# EAGLE design SP (EAGLE 9.4.2)
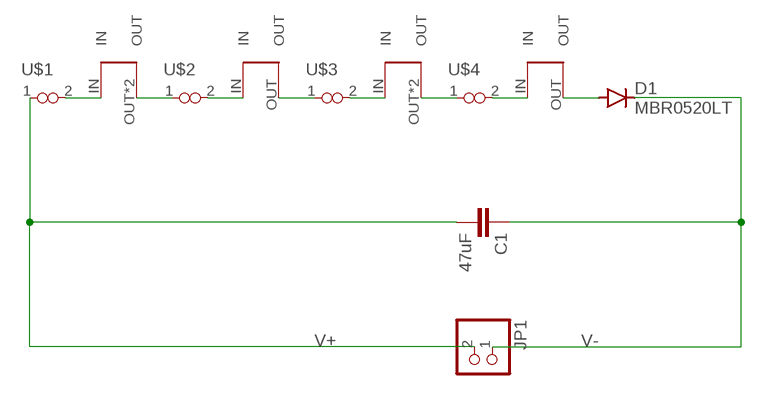
[diagram p0: schematic, sheet 1]

## Parts
C1  47uF  C-EUC1210  [C1210]
D1  MBR0520LT  [SOD123]
JP1  PINHD-1X2  [1X02]
U$1  VIAS-CONNECT  [VIAS-CONNECT]
U$2  VIAS-CONNECT  [VIAS-CONNECT]
U$3  VIAS-CONNECT  [VIAS-CONNECT]
U$4  VIAS-CONNECT  [VIAS-CONNECT]
U$5  SOLAR_1  [SOLAR_1]
U$6  SOLAR_0  [SOLAR_0]
U$7  SOLAR_0  [SOLAR_0]
U$8  SOLAR_1  [SOLAR_1]

## Nets
N$1: U$1.2 U$7.IN
N$2: U$2.1 U$7.OUT U$7.OUT-21(OUT)
N$3: U$2.2 U$5.IN
N$4: D1.A U$8.OUT
N$5: U$3.1 U$5.OUT
N$6: U$3.2 U$6.IN
N$7: U$4.1 U$6.OUT U$6.OUT-21(OUT)
N$8: U$4.2 U$8.IN
V+: C1.2 JP1.2 U$1.1
V-: C1.1 D1.C JP1.1

## Library data of the parts
C1 = rcl:C-EU: CAPACITOR, European symbol; SPICEPREFIX: C
D1 = diode:MBR0520LT: SCHOTTKY BARRIER RECTIFIER Source: http://onsemi.com .. MBR0520LT1-D.pdf
JP1 = pinhead:PINHD-1X2: PIN HEADER
U$1-U$4 = SBV:VIAS-CONNECT
U$5-U$8 = SBV:SOLAR

## Board
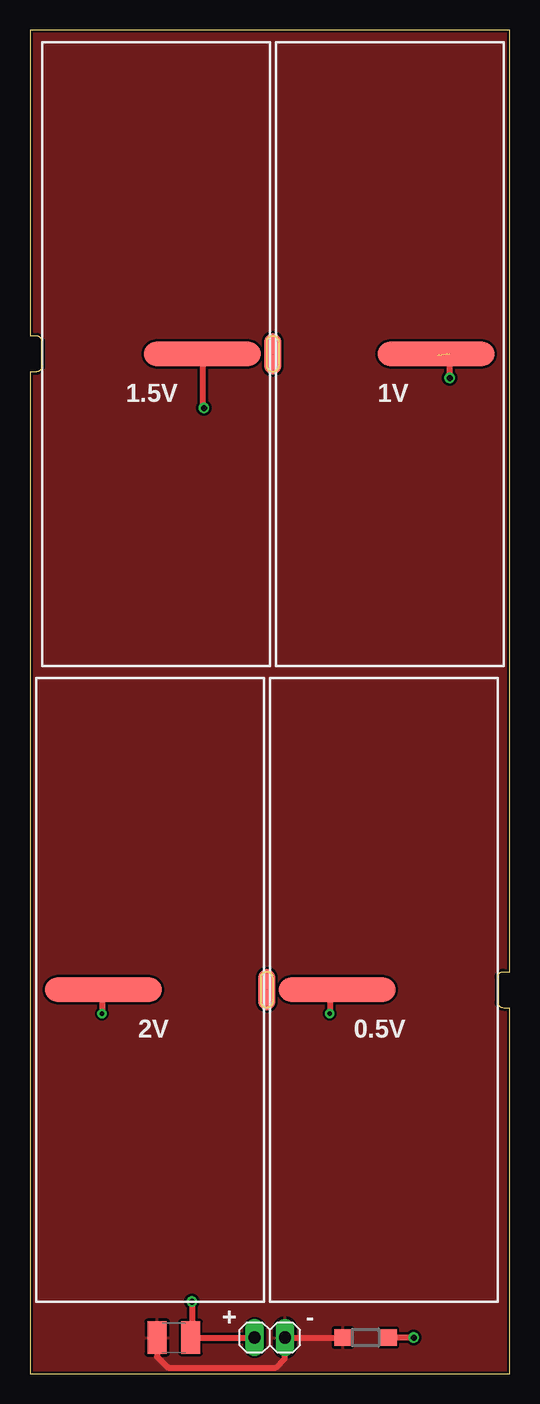
[diagram p1: board, top side]
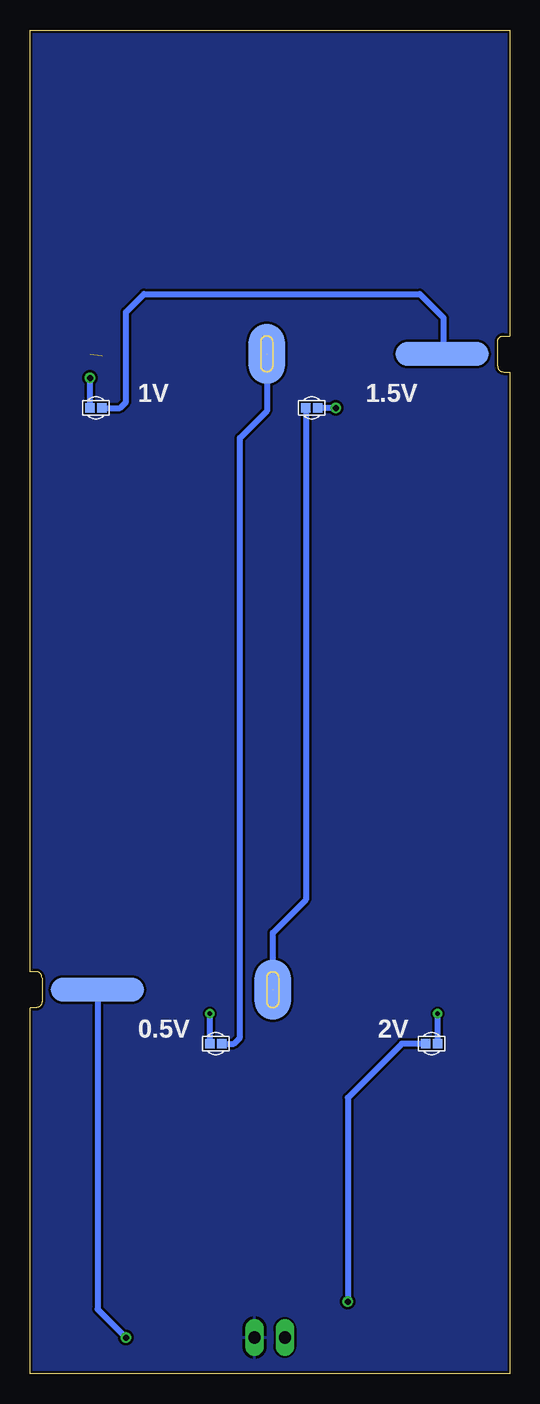
[diagram p2: board, bottom side, seen from below]

Size 40 x 112 mm. Coordinates in mm from the lower left corner, seen from the top.
Outline: 0,0 40,0 40,30.5 39.5,30.5 arc-90 39,31 39,33 arc-90 39.5,33.5 40,33.5 40,112 0,112 0,86.5 0.5,86.5 arc-90 1,86 1,84 arc-90 0.5,83.5 0,83.5 0,0
Copper layers (1*16): Top 0.035mm / dielectric 1.5mm / Bottom 0.035mm
Design rules "default *": minimum track width 0.2mm, minimum drill 0.35mm, track to track 0.2mm, track to pad 0.2mm, pad to pad 0.2mm, via to via 0.2mm, smd to smd 0.2mm, copper to edge 0.2mm, drill to drill 0.2mm, minimum pad ring 10mil, minimum via ring 8mil, stop-mask expansion 4mil, vias tented up to drill 0mil, thermal gap 10mil

### Footprints (pad centres in the part's own frame; a part is rotated, then mirrored left to right if it is on the bottom)
C1210 = smd 1.6 x 2.7: 1 -1.4,0; 2 1.4,0
SOD123 = smd 1.4 x 1.4: A 1.9,0; C -1.9,0
1X02 = drill 1.016 long: 1 -1.27,0; 2 1.27,0
VIAS-CONNECT = smd 0.8 x 0.8: 1 -0.5,0; 2 0.5,0
SOLAR_1 = smd 2 x 9.75: IN 0,-3.875 | smd 2 x 7.75 bottom: OUT 0,4.875
SOLAR_0 = smd 2 x 9.75: IN 0,-3.875 | smd 5 x 3 bottom: OUT 0,9.75 | smd 3.4 x 1.4: OUT-21 0,9.75

### Placement (x,y rotation side)
C1  12,3 0 top
D1  28,3 0 top
JP1  20,3 180 top
U$1  6.5,27.5 0 bottom
U$2  16.5,80.5 0 bottom
U$3  34.5,80.5 180 bottom
U$4  24.5,27.5 180 bottom
U$5  10.5,85 90 top
U$6  30,85 90 top
U$7  10,32 270 top
U$8  29.5,32 270 top

### Tracks (layer width: path | path; a pad name or v marks a point on that pad's centre or on a via)
N$1  (via drill 0.35)
  Top 0.5: U$7.IN 6,31.88 v6,30
  Bottom 0.5: U$1.2 v6,30
N$2  (1 unrouted)
  Bottom 0.5: U$2.1 17,39.5 19.75,36.75 U$7.OUT-21
N$3  (via drill 0.5)
  Top 0.5: U$5.IN 14.38,80.62 v14.5,80.5
  Bottom 0.5: v14.5,80.5 U$2.2
N$4  (via drill 0.5)
  Top 0.5: v32,3 D1.A
  Bottom 0.5: U$8.OUT 34.38,5.38 v32,3
N$5
  Bottom 0.5: U$5.OUT 5.5,85.12 5.5,88 7.5,90 30.5,90 32,88.5 32,81 32.5,80.5 U$3.1
N$6  (via drill 0.5)  (1 unrouted)
  Top 0.2: 34,84.88 U$6.IN
  Top 0.5: v35,83 35,85
  Bottom 0.5: U$3.2 v35,83
N$7  (1 unrouted)
  Bottom 0.5: U$6.OUT-21 20.25,80.25 22.5,78 22.5,28 23,27.5 U$4.1
N$8  (via drill 0.35)
  Top 0.5: U$8.IN 25,31.38 v25,30
  Bottom 0.5: U$4.2 v25,30
V+  (via drill 0.5)
  Top 0.5: C1.2 13.5,3 | 13.5,3 JP1.2 | v13.5,6 13.5,3
  Bottom 0.5: U$1.1 9,27.5 13.5,23 v13.5,6
V-
  Top 0.5: D1.C JP1.1 21.27,1.27 20.5,0.5 11.5,0.5 10.6,1.4 C1.1
  pour Bottom: -0.5,-0.5 -0.5,112.5 41,112.5 41,-0.5
  pour Top: -0.5,-0.5 -0.5,112.5 40.5,112.5 40.5,-0.5

### Text on the board
tNames: 1.5V | 1V | 2V | 0.5V | + | -
bNames: 1.5V | 1V | 2V | 0.5V